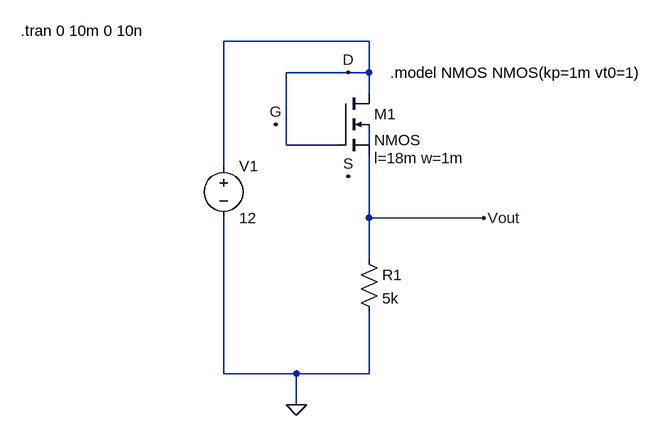
[diagram p0: schematic linear_regulator_mosfet.asc]
linear_regulator_mosfet.asc, the LTspice schematic file:
Version 4
SHEET 1 880 680
WIRE 352 -80 128 -80
WIRE 320 -32 224 -32
WIRE 352 -32 352 -80
WIRE 352 -32 320 -32
WIRE 352 0 352 -32
WIRE 224 80 224 -32
WIRE 304 80 224 80
WIRE 352 80 352 48
WIRE 128 112 128 -80
WIRE 352 192 352 96
WIRE 528 192 352 192
WIRE 352 256 352 192
WIRE 128 432 128 192
WIRE 240 432 128 432
WIRE 352 432 352 336
WIRE 352 432 240 432
WIRE 240 480 240 432
FLAG 240 480 0
FLAG 528 192 Vout
FLAG 320 -32 D
FLAG 208 48 G
FLAG 320 128 S
SYMBOL voltage 128 96 R0
WINDOW 123 0 0 Left 0
WINDOW 39 0 0 Left 0
SYMATTR InstName V1
SYMATTR Value 12
SYMBOL nmos4 304 0 R0
WINDOW 123 56 100 Left 2
SYMATTR InstName M1
SYMATTR Value2 l=18m w=1m
SYMBOL res 336 240 R0
SYMATTR InstName R1
SYMATTR Value 5k
TEXT 384 -32 Left 2 !.model NMOS NMOS(kp=1m vt0=1)
TEXT -184 -96 Left 2 !.tran 0 10m 0 10n

The netlist it stands for:
* linear_regulator_mosfet.asc
V1 D 0 12
M1 D D Vout N001 NMOS l=18m w=1m
R1 Vout 0 5k
.model NMOS NMOS
.model PMOS PMOS
.lib standard.mos
.model NMOS NMOS(kp=1m vt0=1)
.tran 0 10m 0 10n
.backanno
.end